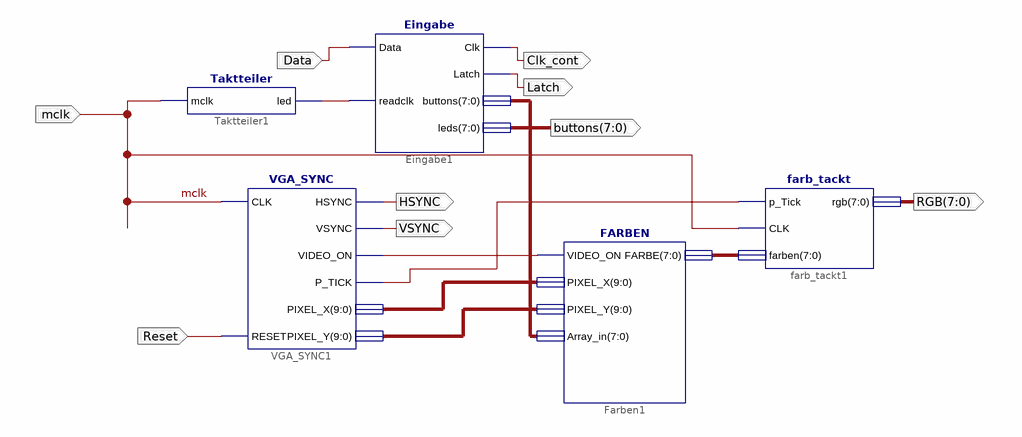
[diagram p0: schematic sheet 1]
// Xilinx ISE schematic Top.sch (spartan3e) as structural Verilog: 5 symbols, 9 ports
module Top (
  input  Data,
  input  Reset,
  input  mclk,
  output Clk_cont,
  output Latch,
  output VSYNC,
  output HSYNC,
  output [7:0] RGB,
  output [7:0] buttons
);

  wire XLXN_7, XLXN_26, XLXN_32;
  wire [7:0] XLXN_31, XLXN_33;
  wire [9:0] XLXN_24, XLXN_25;

  Eingabe Eingabe1 (.readclk(XLXN_7), .Data(Data), .Clk(Clk_cont), .Latch(Latch), .buttons(XLXN_33), .leds(buttons));
  Taktteiler Taktteiler1 (.mclk(mclk), .led(XLXN_7));
  VGA_SYNC VGA_SYNC1 (
    .CLK(mclk), .RESET(Reset), .HSYNC(HSYNC), .VSYNC(VSYNC), .VIDEO_ON(XLXN_26), .P_TICK(XLXN_32),
    .PIXEL_X(XLXN_25), .PIXEL_Y(XLXN_24));
  FARBEN Farben1 (.VIDEO_ON(XLXN_26), .PIXEL_X(XLXN_25), .PIXEL_Y(XLXN_24), .FARBE(XLXN_31), .Array_in(XLXN_33));
  farb_tackt farb_tackt1 (.p_Tick(XLXN_32), .CLK(mclk), .farben(XLXN_31), .rgb(RGB));
endmodule
